# EAGLE design D2NChannelDrivers (EAGLE 5.10)
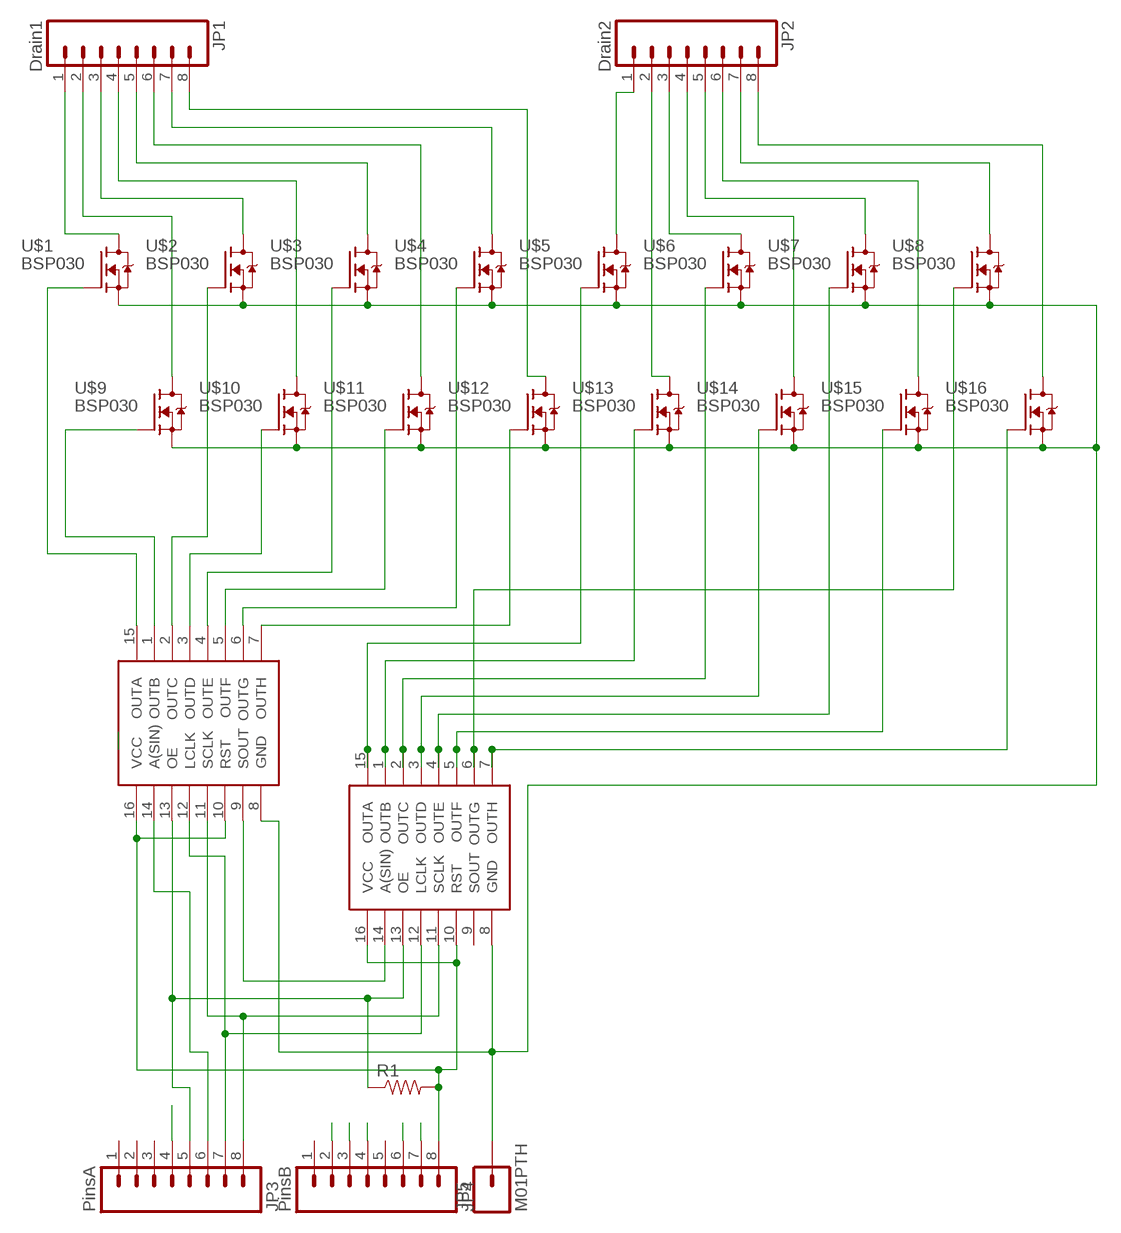
[diagram p0: schematic, sheet 1]

## Parts
JP1  Drain1  M08  [1X08]
JP2  Drain2  M08  [1X08]
JP3  PinsA  M08  [1X08]
JP4  PinsB  M08  [1X08]
JP5  M01PTH  [1X01]
R1  RESISTORPTH1  [AXIAL-0.3]
U$1  BSP030  [SOT223]
U$2  BSP030  [SOT223]
U$3  BSP030  [SOT223]
U$4  BSP030  [SOT223]
U$5  BSP030  [SOT223]
U$6  BSP030  [SOT223]
U$7  BSP030  [SOT223]
U$8  BSP030  [SOT223]
U$9  BSP030  [SOT223]
U$10  BSP030  [SOT223]
U$11  BSP030  [SOT223]
U$12  BSP030  [SOT223]
U$13  BSP030  [SOT223]
U$14  BSP030  [SOT223]
U$15  BSP030  [SOT223]
U$16  BSP030  [SOT223]
U$17  74HC595  [TSSOP16]
U$18  74HC595  [TSSOP16]

## Nets
D1 [power]: JP1.1 U$1.2(D)
D9 [power]: JP2.1 U$5.2(D)
GND: JP5.1 U$1.3(S) U$2.3(S) U$3.3(S) U$4.3(S) U$5.3(S) U$6.3(S) U$7.3(S) U$8.3(S) U$9.3(S) U$10.3(S) U$11.3(S) U$12.3(S) U$13.3(S) U$14.3(S) U$15.3(S) U$16.3(S) U$17.8(GND) U$18.8(GND)
N$1: JP3.4
N$2: JP4.2
N$3: JP4.3
N$4: JP4.4
N$6: JP4.6
N$7: JP4.7
N$8: JP3.5 R1.P$1 U$17.13(OE) U$18.13(OE)
N$9: JP3.6 U$17.14(A(SIN))
N$10: U$17.9(SOUT) U$18.14(A(SIN))
N$11: U$1.1(G) U$17.15(OUTA)
N$12: U$9.1(G) U$17.1(OUTB)
N$13: U$2.1(G) U$17.2(OUTC)
N$14: U$10.1(G) U$17.3(OUTD)
N$15: U$3.1(G) U$17.4(OUTE)
N$16: U$11.1(G) U$17.5(OUTF)
N$17: U$4.1(G) U$17.6(OUTG)
N$18: U$12.1(G) U$17.7(OUTH)
N$19: U$5.1(G) U$18.15(OUTA)
N$20: U$13.1(G) U$18.1(OUTB)
N$21: U$6.1(G) U$18.2(OUTC)
N$22: U$14.1(G) U$18.3(OUTD)
N$23: U$7.1(G) U$18.4(OUTE)
N$24: U$15.1(G) U$18.5(OUTF)
N$25: U$8.1(G) U$18.6(OUTG)
N$26: U$16.1(G) U$18.7(OUTH)
N$27: JP3.8 U$17.11(SCLK) U$18.11(SCLK)
N$29 [power]: JP1.2 U$9.2(D)
N$30 [power]: JP1.3 U$2.2(D)
N$31 [power]: JP1.4 U$10.2(D)
N$32 [power]: JP1.5 U$3.2(D)
N$33 [power]: JP1.6 U$11.2(D)
N$34 [power]: JP1.7 U$4.2(D)
N$35 [power]: JP1.8 U$12.2(D)
N$37 [power]: JP2.2 U$13.2(D)
N$38 [power]: JP2.3 U$6.2(D)
N$39 [power]: JP2.4 U$14.2(D)
N$40 [power]: JP2.5 U$7.2(D)
N$41 [power]: JP2.6 U$15.2(D)
N$42 [power]: JP2.7 U$8.2(D)
N$43 [power]: JP2.8 U$16.2(D)
N$44: JP3.7 U$17.12(LCLK) U$18.12(LCLK)
VCC: JP4.8 R1.P$2 U$17.10(RST) U$17.16(VCC) U$18.10(RST) U$18.16(VCC)
Unconnected: JP3.1 JP3.2 JP3.3 JP4.1 JP4.5 U$18.9(SOUT)

## Library data of the parts
JP1-JP4 = SparkFun:M08: Header 8 Standard 8-pin 0.1" header. Use with straight break away headers (SKU : PRT-00116), right angle break away headers (PRT-00553), swiss pins (PRT-00743), machine pins (PRT-00117), and female headers (PRT-00115).
JP5 = SparkFun:M01: Header 1 Standard 1-pin 0.1" header. Use with straight break away headers (SKU : PRT-00116), right angle break away headers (PRT-00553), swiss pins (PRT-00743), machine pins (PRT-00117), and female headers (PRT-00115).
R1 = SparkFun:RESISTOR: Resistor Basic schematic elements and footprints for 0603, 1206, and PTH 1/10th watt (small) resistors.
U$1-U$16 = transistor-fet:BSP030
U$17 U$18 = SparkFun:74HC595

## Net classes
0 default: width 0.203 mm, drill 0.508 mm, clearance 0.203 mm
1 power: width 0.508 mm, drill 0.508 mm, clearance 0.203 mm

## Board
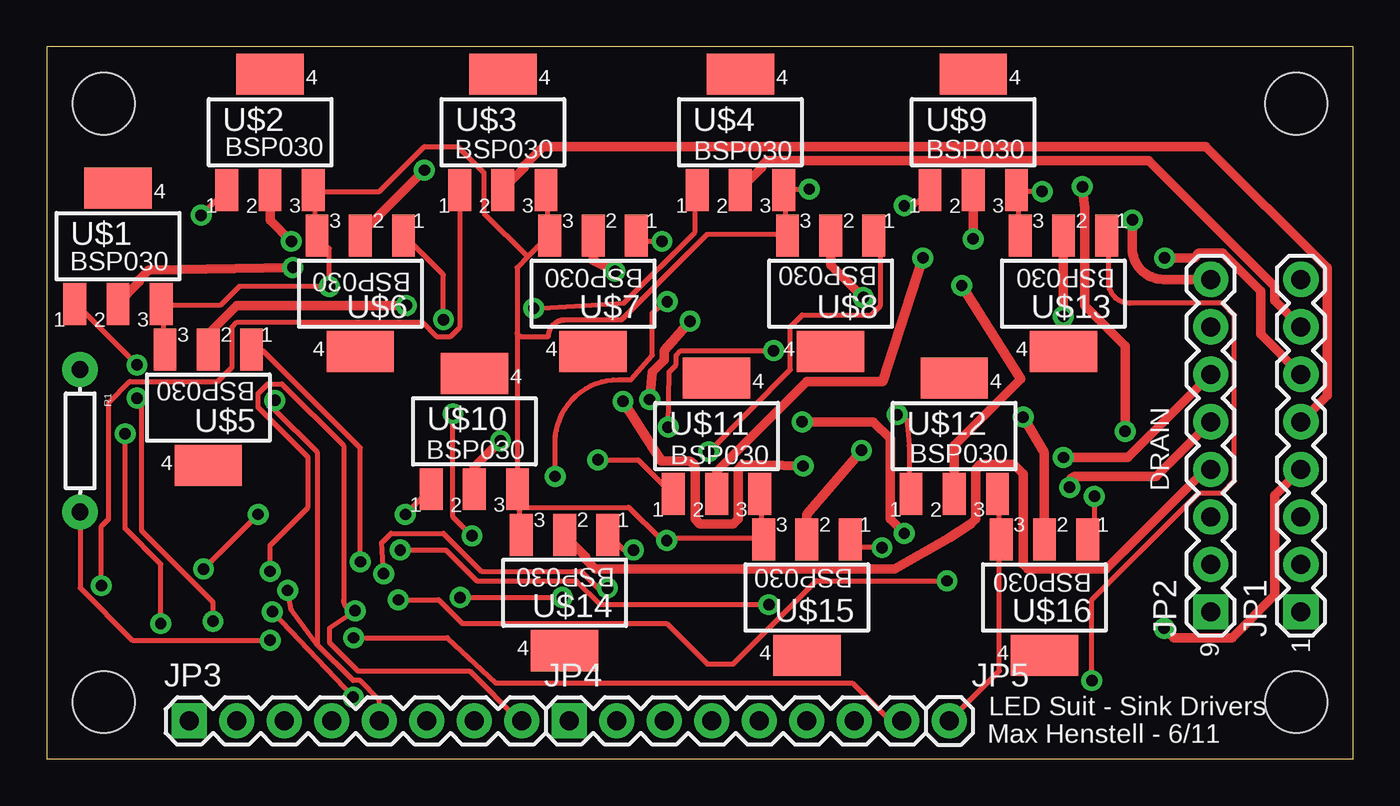
[diagram p1: board, top side]
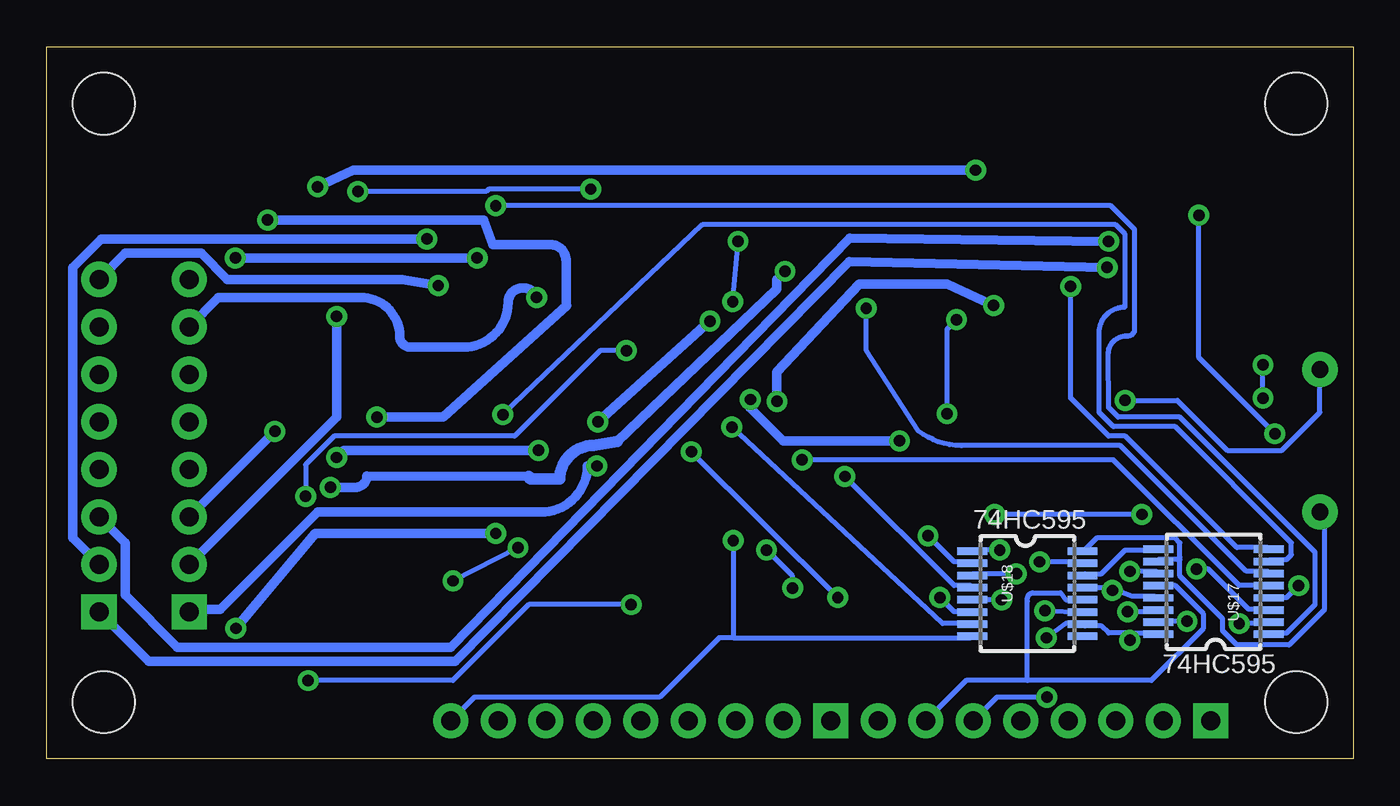
[diagram p2: board, bottom side, seen from below]

Size 69.85 x 38.1 mm. Coordinates in mm from the lower left corner, seen from the top.
Outline: 0,0 69.85,0 69.85,38.1 0,38.1 0,0
Copper layers (1*16): Top 0.035mm / dielectric 1.5mm / Bottom 0.035mm
Design rules "SparkFun": minimum track width 8mil, minimum drill 20mil, track to track 8mil, track to pad 8mil, pad to pad 8mil, via to via 8mil, smd to smd 8mil, copper to edge 10mil, drill to drill 8mil, minimum pad ring 12mil, minimum via ring 10mil, stop-mask expansion 4mil, vias tented up to drill 25mil, thermal gap 10mil

### Footprints (pad centres in the part's own frame; a part is rotated, then mirrored left to right if it is on the bottom)
1X08 = drill 1.016 pad 1.88 square: 1 0,0 | drill 1.016 pad 1.88 round: 2 2.54,0; 3 5.08,0; 4 7.62,0; 5 10.16,0; 6 12.7,0; 7 15.24,0; 8 17.78,0
1X01 = drill 1.016 pad 1.88 round: 1 0,0
AXIAL-0.3 = drill 0.9 pad 1.88 round: P$1 -3.81,0; P$2 3.81,0
SOT223 = smd 1.219 x 2.235: 1 -2.311,-3.099; 2 0,-3.099; 3 2.311,-3.099 | smd 3.6 x 2.2: 4 0,3.099
TSSOP16 = smd 0.4 x 1.6: 1 -2.225,-2.85; 2 -1.575,-2.85; 3 -0.925,-2.85; 4 -0.275,-2.85; 5 0.375,-2.85; 6 1.025,-2.85; 7 1.675,-2.85; 8 2.325,-2.85; 9 2.325,3.05; 10 1.675,3.05; 11 1.025,3.05; 12 0.375,3.05; 13 -0.275,3.05; 14 -0.925,3.05; 15 -1.575,3.05; 16 -2.225,3.05
STAND-OFF = hole 3.302: 0,0

### Placement (x,y rotation side)
JP1  67.06,7.87 90 top
JP2  62.23,7.87 90 top
JP3  7.62,2.03 0 top
JP4  27.94,2.03 0 top
JP5  48.26,2.03 0 top
R1  1.78,17.02 270 top
U$1  3.81,27.43 0 top
U$2  11.94,33.53 0 top
U$3  24.38,33.53 0 top
U$4  37.08,33.53 0 top
U$5  8.64,18.8 180 top
U$6  16.76,24.89 180 top
U$7  29.21,24.89 180 top
U$8  41.91,24.89 180 top
U$9  49.53,33.53 0 top
U$10  22.86,17.53 0 top
U$11  35.81,17.27 0 top
U$12  48.51,17.27 0 top
U$13  54.36,24.89 180 top
U$14  27.69,8.89 180 top
U$15  40.64,8.64 180 top
U$16  53.34,8.64 180 top
U$17  7.37,8.89 90 bottom
U$18  17.53,8.89 270 bottom
U$19  [STAND-OFF]  3.05,35.05 0 top
U$20  [STAND-OFF]  3.05,3.05 0 top
U$21  [STAND-OFF]  66.8,3.05 0 top
U$22  [STAND-OFF]  66.8,35.05 0 top

### Tracks (layer width: path | path; a pad name or v marks a point on that pad's centre or on a via)
D1  (via drill 0.61)
  Top 0.508: v13.16,26.29 5.46,26.16 4.95,25.65 4.95,25.53 3.81,24.38 U$1.2
  Bottom 0.508: v13.16,26.29 26.95,26.59 48.01,5.21 64.39,5.21 JP1.1
D9  (via drill 0.61)
  Top 0.508: v19.23,24.26 10.16,24.26 8.64,22.73 U$5.2 | v30.81,19.13 32.84,15.95 34.21,15.95 arc-90 34.67,15.49 34.67,12.83 34.92,12.57 36.7,12.57 36.96,12.83 36.96,15.49 37.21,15.75 v40.44,15.67
  Bottom 0.508: v19.23,24.26 20.17,24.69 21.72,25.4 26.42,25.4 30.81,20.7 v30.81,19.13 | v40.44,15.67 40.95,15.67 arc90 43.43,13.21 55.37,13.21 60.58,8 62.1,8 JP2.1
GND  (via drill 0.61)
  Top 0.254: U$12.3 50.93,14.1 50.93,11.81 U$16.3 50.93,11.68 50.93,4.7 JP5.1 | U$5.3 6.22,21.97 6.22,24.26 U$1.3 6.35,24.26 9.27,24.26 10.29,25.27 v15.11,25.27 15.11,27.3 14.48,27.94 U$6.3 14.35,28.07 14.35,30.35 U$2.3 14.48,30.35 17.78,30.35 20.19,32.77 21.97,32.77 23.37,31.37 23.37,29.21 25.72,26.86 | U$13.3 51.94,28.07 51.94,30.35 U$9.3 52.07,30.35 v53.21,30.35 | U$11.3 38.23,14.1 38.23,11.81 U$15.3 38.1,11.81 33.15,11.81 | 25.27,13.46 25.27,14.35 U$10.3 | 25.27,13.46 25.27,12.06 U$14.3 | U$3.3 26.8,30.35 26.8,28.07 U$7.3 26.8,27.94 25.72,26.86 | 25.15,22.81 25.15,26.29 25.72,26.86 | 25.15,22.81 25.15,14.48 U$10.3 | 33.15,11.81 32.77,11.81 31.11,13.46 25.27,13.46 | U$10.3 25.27,13.46 | v40.77,30.48 39.5,30.48 U$4.3 39.5,30.35 39.5,28.07 U$8.3 39.37,28.07 35.31,28.07 30.73,23.5 27.71,23.5 arc90 26.82,22.61 25.35,22.61 arc-90 25.15,22.81 | 33.15,11.81 v33.15,11.68
  Bottom 0.254: 33.15,6.48 33.91,6.48 37.08,3.3 46.99,3.3 JP5.1 | 33.15,6.48 20.45,6.48 U$18.8 | v15.11,25.27 15.11,19.3 13.08,17.27 12.19,17.27 6.22,11.3 4.57,11.3 U$17.8 | v53.21,30.35 46.35,30.35 46.23,30.48 v40.77,30.48 | v33.15,11.68 33.15,6.48
N$8  (via drill 0.61)
  Top 0.254: v12.88,9.02 13.08,7.98 14.41,6.16 | 14.41,6.16 16.38,4.19 16.76,4.19 17.78,3.17 JP3.5 | v12.19,19.18 12.19,18.67 14.48,16.38 14.48,6.22 14.41,6.16
  Bottom 0.254: 12.95,9.14 11.84,8.71 10.62,8.71 10.54,8.64 U$17.13 | 12.95,9.14 14.35,9.14 U$18.13 | v12.88,9.02 12.95,9.14 | R1.P$1 1.78,18.54 3.81,16.51 6.73,16.51 9.4,19.18 v12.19,19.18
N$9  (via drill 0.61)
  Top 0.254: v12.06,7.87 v16.38,3.3
  Bottom 0.254: v12.06,7.87 10.54,7.87 U$17.14 | v16.38,3.3 19.05,3.3 JP3.6
N$10
  Bottom 0.254: U$17.9 10.54,11.18 12.19,11.18 13.46,9.91 14.35,9.91 U$18.14
N$11  (via drill 0.61)
  Top 0.254: v8.89,7.37 8.89,8.38 5.08,12.19 5.08,19.05 v4.83,19.3 | v4.83,21.08 1.52,24.38 U$1.1
  Bottom 0.254: v8.89,7.37 10.41,7.37 U$17.15 | v4.83,19.3 v4.83,21.08
N$12  (via drill 0.61)
  Top 0.254: v45.85,29.59 46.35,29.59 47.12,30.35 U$9.1
  Bottom 0.254: v45.85,29.59 12.95,29.59 11.68,28.32 11.68,22.99 arc90 12.04,22.63 12.12,22.63 arc-90 13.1,21.65 13.08,18.8 12.57,18.29 9.27,18.29 2.03,11.05 2.03,8.26 3.56,6.73 4.45,6.73 U$17.1
N$13  (via drill 0.61)
  Top 0.254: v6.1,7.24 6.1,10.41 4.19,12.32 v4.19,17.4 | v8.26,29.08 9.53,30.35 U$2.1
  Bottom 0.254: v6.1,7.24 4.57,7.24 U$17.2 | v4.19,17.4 8.26,21.46 v8.26,29.08
N$14  (via drill 0.61)
  Top 0.254: v8.38,10.16 v11.3,13.08 | v19.18,13.08 20.45,14.35 U$10.1
  Bottom 0.254: v8.38,10.16 7.75,10.16 5.59,8 4.57,8 U$17.3 | v11.3,13.08 v19.18,13.08
N$15  (via drill 0.61)
  Top 0.254: v2.92,9.27 2.92,12.45 3.3,12.83 3.3,19.05 4.45,20.19 9.14,20.19 9.91,20.95 9.91,23.11 10.16,23.37 20.07,23.37 20.83,22.61 21.59,22.61 22.1,23.11 22.1,30.35 U$3.1
  Bottom 0.254: v2.92,9.27 3.56,8.64 4.45,8.64 U$17.4
N$16  (via drill 0.61)
  Top 0.254: v29.46,16 31.62,16 33.4,14.22 U$11.1
  Bottom 0.254: v29.46,16 12.83,16 6.1,9.27 4.57,9.27 U$17.5
N$17  (via drill 0.61)
  Top 0.254: v26.04,24.11 30.86,24.38 34.67,28.19 34.67,30.35 U$4.1
  Bottom 0.254: v26.04,24.11 26.04,21.84 23.27,17.55 arc-38 20.95,16.76 12.45,16.76 5.71,10.03 4.57,10.03 U$17.6
N$18  (via drill 0.61)
  Top 0.254: v45.47,18.41 45.97,18.16 46.1,16.76 46.1,14.22 U$12.1
  Bottom 0.254: v45.47,18.41 34.8,28.57 12.7,28.57 12.19,28.07 12.19,26.92 12.19,24.18 arc-90 13.59,22.78 13.59,18.54 12.83,17.78 9.53,17.78 3.3,11.56 3.3,10.92 3.56,10.67 4.45,10.67 U$17.7
N$19  (via drill 0.61)
  Top 0.254: v16.76,10.54 16.76,16.64 11.56,21.84 11.05,21.84 U$5.1
  Bottom 0.254: v16.76,10.54 14.48,10.54 U$18.15
N$20  (via drill 0.61)
  Top 0.254: v18.9,11.18 21.34,11.18 22.99,9.53 28.32,9.53 29.59,8.26 v38.61,8.26 | v55.88,4.19 55.88,8.51 61.59,14.22 62.87,14.22 63.5,14.86 63.5,23.75 62.87,24.38 57.88,24.38 arc-90 56.77,25.5 56.77,27.94 U$13.1
  Bottom 0.254: v18.9,11.18 20.32,11.18 U$18.1 | v38.61,8.26 44.07,8.26 48.13,4.19 v55.88,4.19
N$21  (via drill 0.61)
  Top 0.254: v22.73,11.94 21.72,12.95 v21.72,18.47 | v21.21,23.5 21.21,25.91 19.18,27.94 U$6.1
  Bottom 0.254: v22.73,11.94 21.34,10.54 20.45,10.54 U$18.2 | v21.72,18.47 21.72,22.99 v21.21,23.5
N$22  (via drill 0.61)
  Top 0.254: v18.01,9.91 17.91,11.56 18.41,12.06 21.21,12.06 23.24,10.03 28.57,10.03 29.46,9.14 v29.97,9.14 | v31.37,11.18 30.86,11.18 30.1,11.94 U$14.1
  Bottom 0.254: v18.01,9.91 20.32,9.91 U$18.3 | v29.97,9.14 29.97,9.78 v31.37,11.18
N$23  (via drill 0.61)
  Top 0.254: v27.18,15.11 27.18,16.94 arc-90 30.58,20.3 31.24,20.3 32.36,21.59 32.38,21.59 32.38,23.88 v33.17,24.46 | v32.89,27.69 31.88,27.69 31.62,27.94 U$7.1
  Bottom 0.254: v27.18,15.11 21.34,9.27 20.45,9.27 U$18.4 | v33.17,24.46 v32.89,27.69
N$24  (via drill 0.61)
  Top 0.254: v18.8,8.51 20.95,8.51 22.23,7.24 33.15,7.24 35.31,5.08 36.7,5.08 41.15,9.53 v48.13,9.53 | v44.65,11.3 43.43,11.3 43.05,11.68 U$15.1
  Bottom 0.254: v18.8,8.51 20.32,8.51 U$18.5 | v48.13,9.53 v44.65,11.3
N$25  (via drill 0.61)
  Top 0.254: v22.1,8.64 v27.56,8.64 | v35.38,16.43 39.75,20.83 39.75,23.11 40.39,23.75 44.07,23.75 44.58,24.26 44.58,27.69 44.32,27.94 U$8.1
  Bottom 0.254: v22.1,8.64 21.34,7.87 20.45,7.87 U$18.6 | v27.56,8.64 v35.38,16.43
N$26  (via drill 0.61)
  Top 0.254: v33.22,17.75 33.27,20.7 33.66,21.08 33.66,21.59 33.91,21.84 v38.86,21.84 | v56.01,14.05 56.01,12.06 55.75,11.81 U$16.1
  Bottom 0.254: v33.22,17.75 21.97,7.24 20.45,7.24 U$18.7 | v38.86,21.84 40.26,21.84 44.83,17.27 54.48,17.27 56.01,15.75 v56.01,14.05
N$27  (via drill 0.61)
  Top 0.254: JP3.8 25.27,2.03 22.61,4.7 16.64,4.7 15.11,6.22 15.11,6.99 v16.48,7.92 arc-95 15.88,8.49 15.88,16.76 12.57,20.07 11.81,20.07 11.3,19.56 11.3,18.8 13.97,16.13 13.97,13.46 11.94,11.43 v11.94,10.03
  Bottom 0.254: v16.48,7.92 U$18.11 | v11.94,10.03 10.54,10.03 U$17.11
N$29  (via drill 0.61)
  Top 0.508: v49.53,27.81 U$9.2
  Bottom 0.508: v49.53,27.81 66.93,27.81 68.45,26.29 68.45,11.81 JP1.2
N$30  (via drill 0.61)
  Top 0.508: v13.08,27.69 11.94,28.83 U$2.2
  Bottom 0.508: v13.08,27.69 26.92,27.86 48.26,5.97 62.87,5.97 65.66,8.76 65.66,11.56 JP1.3
N$31  (via drill 0.61)
  Top 0.508: v24.26,17.02 22.86,15.62 U$10.2 | v32.23,19.23 32.38,20.7 33.02,21.34 33.02,21.84 v34.39,23.42 | v40.39,18.03 44.2,18.03 45.09,17.14 45.09,12.83 v45.85,12.06 | v59.74,6.99 60.25,6.48 63.37,6.48 65.66,8.76 65.66,14.1 JP1.4
  Bottom 0.508: v24.26,17.02 30.48,17.02 32.26,18.8 32.26,19.13 v32.23,19.23 | v34.39,23.42 v40.39,18.03 | v45.85,12.06 55.5,12.06 v59.74,6.99
N$32
  Top 0.508: JP1.5 68.45,19.43 68.45,26.29 61.98,32.77 26.54,32.77 25.53,31.75 25.53,31.62 24.38,30.48 U$3.2
N$33  (via drill 0.61)
  Top 0.508: v46.84,26.8 44.7,20.19 40.64,20.19 35.81,15.37 U$11.2 | v59.77,26.8 61.34,26.8 61.59,27.05 62.87,27.05 64.9,25.02 64.9,22.73 JP1.6
  Bottom 0.508: v46.84,26.8 v59.77,26.8
N$34
  Top 0.508: JP1.7 65.66,24.51 65.66,25.27 58.93,32 38.48,32 38.23,31.75 38.23,31.62 37.08,30.48 U$4.2
N$35  (via drill 0.61)
  Top 0.508: v48.92,25.32 52.07,20.32 48.51,16.76 U$12.2
  Bottom 0.508: v48.92,25.32 50.85,25.65 60.2,25.65 61.59,27.05 65.66,27.05 JP1.8
N$37  (via drill 0.61)
  Top 0.508: v54.36,23.67 U$13.2
  Bottom 0.508: v54.36,23.67 54.36,18.29 JP2.2
N$38  (via drill 0.61)
  Top 0.508: v20.19,31.5 16.76,28.07 U$6.2 | v55.37,30.61 55.5,29.46 55.5,24.26 57.66,22.1 v57.66,17.53
  Bottom 0.508: v20.19,31.5 53.47,31.5 v55.37,30.61 | v57.66,17.53 JP2.3
N$39
  Top 0.508: JP2.4 61.98,15.49 56.64,10.16 52.45,10.16 52.2,10.41 52.2,15.24 51.69,15.75 49.91,15.75 49.66,15.49 49.66,12.83 49.4,12.57 48.26,11.81 45.34,10.16 29.34,10.16 28.83,10.67 28.83,10.79 27.69,11.94 U$14.2
N$40  (via drill 0.61)
  Top 0.508: v30.38,26.09 29.21,26.67 U$7.2 | v54.69,14.53 54.69,14.76 arc-90 55.04,15.11 59.31,15.11 JP2.5
  Bottom 0.508: 39.34,16.99 30.81,25.15 30.81,25.65 v30.38,26.09 | 44.07,15.11 52.73,15.14 arc90 53.34,14.53 v54.69,14.53
  Bottom 0.61: 39.34,16.99 40.64,16.76 arc-90 42.42,14.99 43.94,14.99 arc90 44.07,15.11
N$41  (via drill 0.61)
  Top 0.508: v43.56,16.51 40.64,13.08 U$15.2 | v54.36,16.13 57.78,16.13 JP2.6
  Bottom 0.508: v43.56,16.51 53.98,16.51 v54.36,16.13
N$42  (via drill 0.61)
  Top 0.508: v43.66,24.69 41.91,26.42 U$8.2
  Bottom 0.508: JP2.7 60.68,24.69 53.06,24.69 arc90 50.98,22.61 arc-90 50.39,22.02 47.57,22.02 arc-90 45.19,24.41 arc159 v43.66,24.69
N$43  (via drill 0.61)
  Top 0.508: v52.2,18.29 53.34,16.38 U$16.2 | v58.04,28.83 58.04,27.3 arc90 59.69,25.65 JP2.8
  Bottom 0.508: v52.2,18.29 48.64,18.29 42.06,24.26 42.09,24.28 42.09,26.68 arc-90 42.91,27.51 46,27.51 46.48,28.83 v58.04,28.83
N$44
  Bottom 0.254: 17.42,4.19 20.7,4.19 JP3.7 | 17.42,4.19 10.79,4.19 8,6.99 8,7.75 9.53,9.27 U$17.12 | 17.42,4.19 17.42,8.45 arc90 17.14,8.89 15.65,8.89 15.37,8.51 U$18.12
VCC  (via drill 0.61)
  Top 0.254: v11.94,6.35 4.57,6.35 1.78,9.14 R1.P$2 | JP4.8 45.09,2.03 43.05,4.06 24,4.06 21.41,6.48 v16.41,6.48
  Bottom 0.254: 9.34,10.73 9.27,10.79 9.27,11.56 9.53,11.81 13.72,11.81 14.35,11.18 U$18.16 | 9.34,10.73 9.4,10.67 10.41,10.67 U$17.10 | 11.94,6.73 13.08,6.73 13.46,7.11 14.35,7.11 U$18.10 14.61,7.24 15.37,7.24 v16.41,6.48 | 11.94,6.73 10.54,6.73 U$17.16 | v11.94,6.35 11.94,6.73 | R1.P$2 1.52,12.95 1.52,8 3.43,6.1 6.22,6.1 6.99,6.86 6.99,7.49 9.27,9.78 9.27,10.67 9.34,10.73

### Text on the board
tPlace: BSP030 | BSP030 | BSP030 | BSP030 | BSP030 | BSP030 | BSP030 | BSP030 | BSP030 | BSP030 | BSP030 | BSP030 | BSP030 | DRAIN | BSP030 | BSP030 | BSP030 | 1 | 9 | LED Suit - Sink Drivers | Max Henstell - 6/11
bPlace: 74HC595 | 74HC595